# Altium schematic sheet 24V_Conv_Draft.SchDoc
size A; SheetNumber: 16; SheetTotal: 16
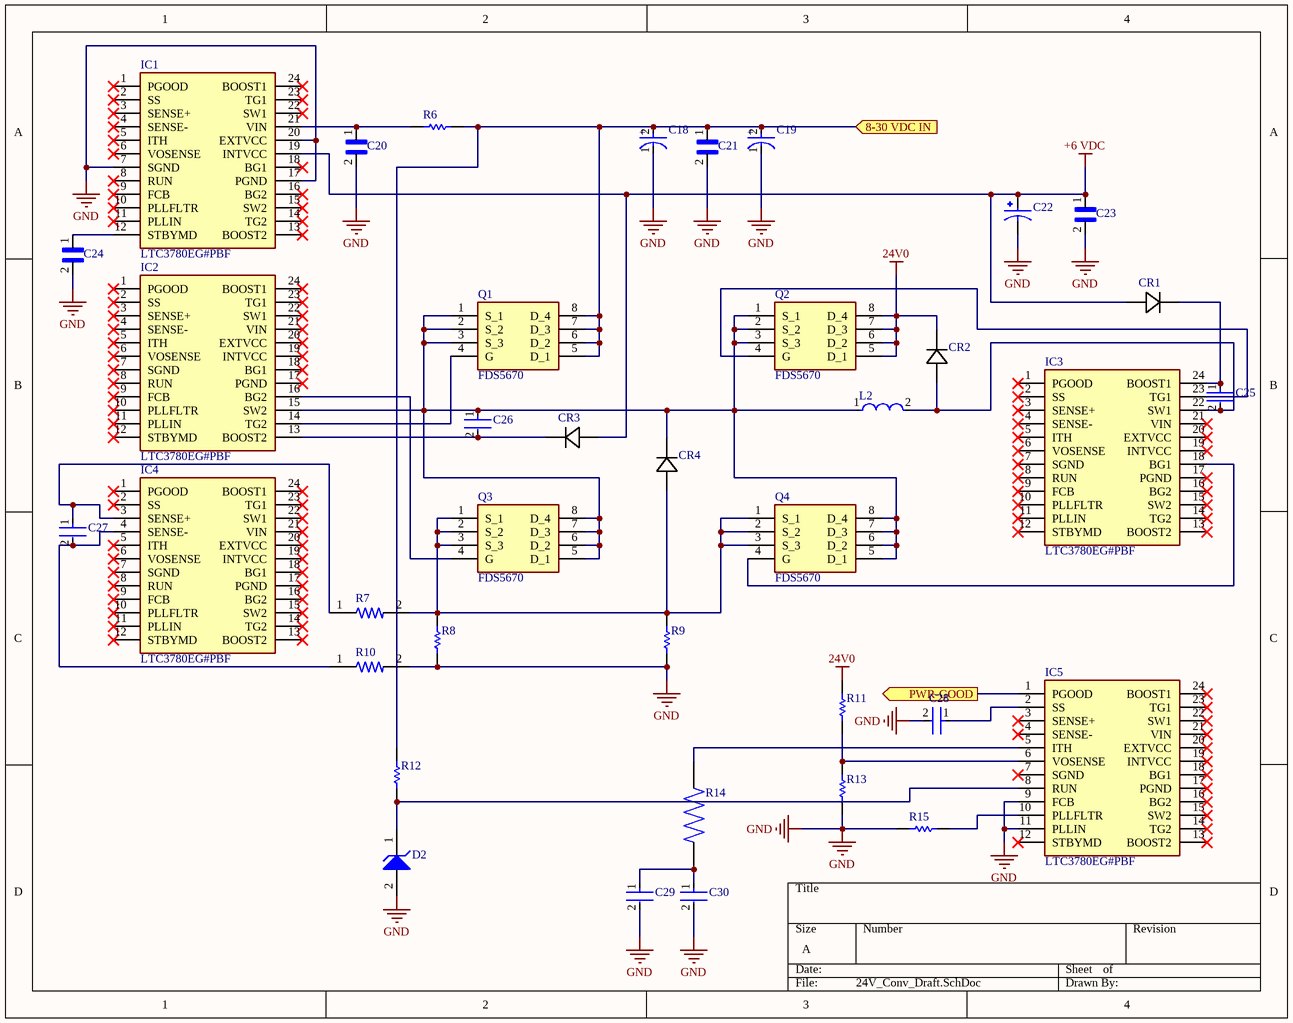
[diagram p0: 24V_Conv_Draft.SchDoc]

## Parts
C18  35SVPF22M  [FP-SVPFC6-MFG]  (value not drawn)
C19  EEE-HA1E221UP  [FP-HAF-MFG]  (value not drawn)
C20  GRM022R60J104ME15L  [CAPC0402X22N]  (value not drawn)
C21  GRM022R60J104ME15L  [CAPC0402X22N]  (value not drawn)
C22  EEVEB2V4R7Q  [CAP_EEVEB2V4R7Q]  (value not drawn)
C23  GRM022R60J104ME15L  [CAPC0402X22N]  (value not drawn)
C24  GRM022R60J104ME15L  [CAPC0402X22N]  (value not drawn)
C25  C0805C224K5RACTU  [FP-C0805C-DN-IPC_A]  (value not drawn)
C26  C0805C224K5RACTU  [FP-C0805C-DN-IPC_A]  (value not drawn)
C27  C1206C680J5GACTU  [FP-C1206C-EB-MFG]  (value not drawn)
C28  CC0805KRX7R9BB223  [FP-CC0805-0_85-IPC_C]  (value not drawn)
C29  C1206C470J5GACTU  [FP-C1206C-EB-MFG]  (value not drawn)
C30  CC0603KRX7R9BB103  [FP-CC0603-DA-IPC_B]  (value not drawn)
CR1  SS34-E3/9AT  [CR_3/9AT_VIS]  (value not drawn)
CR2  SS34-E3/9AT  [CR_3/9AT_VIS]  (value not drawn)
CR3  SS34-E3/9AT  [CR_3/9AT_VIS]  (value not drawn)
CR4  SS34-E3/9AT  [CR_3/9AT_VIS]  (value not drawn)
D2  MMSZ4689T1G  [ONSC-SOD-123-2-425-04_V]  (value not drawn)
IC1  LTC3780EG#PBF  [SOP65P780X200-24N]
IC2  LTC3780EG#PBF  [SOP65P780X200-24N]
IC3  LTC3780EG#PBF  [SOP65P780X200-24N]
IC4  LTC3780EG#PBF  [SOP65P780X200-24N]
IC5  LTC3780EG#PBF  [SOP65P780X200-24N]
L2  IHLP5050CEER4R7M01  [FP-IHLP-5050CE-FP_3_175x3-MFG]  (value not drawn)
Q1  FDS5670  [SOIC127P600X175-8N]
Q2  FDS5670  [SOIC127P600X175-8N]
Q3  FDS5670  [SOIC127P600X175-8N]
Q4  FDS5670  [SOIC127P600X175-8N]
R6  ERJ-6ENF10R0V  [RESC2013X70X40NL20T20]  (value not drawn)
R7  CRGS0805J100R  [RESC2012X65N]  (value not drawn)
R8  ERJ8BWFR018V  [RESC3216X70X50NL05T20]  (value not drawn)
R9  ERJ8BWFR018V  [RESC3216X70X50NL05T20]  (value not drawn)
R10  CRGS0805J100R  [RESC2012X65N]  (value not drawn)
R11  CRCW1206294KFKEA  [RESC3216X60X45ML10T20]  (value not drawn)
R12  ERJ3EKF1002V  [RESC1609X55X30LL15T15]  (value not drawn)
R13  ERJ3EKF1002V  [RESC1609X55X30LL15T15]  (value not drawn)
R14  RC1206JR-07100KL  [RESC3116X65N]  (value not drawn)
R15  ERJ3EKF1002V  [RESC1609X55X30LL15T15]  (value not drawn)

## Ports
8-30 VDC IN (in), PWR-GOOD (out)

## Nets
24V0: CR2.2(ANODE) Q2.5(D_1) Q2.6(D_2) Q2.7(D_3) Q2.8(D_4) R11.1
+6 VDC: C22.1 C23.1 CR1.1(CATHODE) CR3.1(CATHODE) IC1.19(INTVCC)
GND: C18.1(C) C19.1(C) C20.2 C21.2 C22.2 C23.2 C24.2 C28.2 C29.2 C30.2 D2.2(A) IC1.7(SGND) IC1.17(PGND) IC1.20(EXTVCC) IC5.9(FCB) IC5.11(PLLIN) R8.2 R9.2 R10.2 R13.2 R15.2
8-30 VDC IN: C18.2(A) C19.2(A) C21.1 Q1.5(D_1) Q1.6(D_2) Q1.7(D_3) Q1.8(D_4) R6.2 R12.1 ; port 8-30 VDC IN
PWR-GOOD: IC5.1(PGOOD) ; port PWR-GOOD
NetC20_1: C20.1 IC1.21(VIN) R6.1
NetC24_1: C24.1 IC1.12(STBYMD)
NetC25_1: C25.1 CR1.2(ANODE) IC3.24(BOOST1)
NetC25_2: C25.2 CR2.1(CATHODE) IC3.22(SW1) L2.2
NetC26_1: C26.1 CR4.2(ANODE) IC2.15(SW2) L2.1 Q1.1(S_1) Q1.2(S_2) Q1.3(S_3) Q2.1(S_1) Q2.2(S_2) Q2.3(S_3) Q3.5(D_1) Q3.6(D_2) Q3.7(D_3) Q3.8(D_4) Q4.5(D_1) Q4.6(D_2) Q4.7(D_3) Q4.8(D_4)
NetC26_2: C26.2 CR3.2(ANODE) IC2.13(BOOST2)
NetC27_1: C27.1 IC4.3(SENSE+) R7.1
NetC27_2: C27.2 IC4.4(SENSE-) R10.1
NetC28_1: C28.1 IC5.2(SS)
NetC29_1: C29.1 C30.1 R14.2
NetCR4_1: CR4.1(CATHODE) Q3.1(S_1) Q3.2(S_2) Q3.3(S_3) Q4.1(S_1) Q4.2(S_2) Q4.3(S_3) R7.2 R8.1 R9.1
NetD2_1: D2.1(K) IC5.8(RUN) R12.2
NetIC2_14: IC2.14(TG2) Q1.4(G)
NetIC2_16: IC2.16(BG2) Q3.4(G)
NetIC3_18: IC3.18(BG1) Q4.4(G)
NetIC3_23: IC3.23(TG1) Q2.4(G)
NetIC5_5: IC5.5(ITH) R14.1
NetIC5_6: IC5.6(VOSENSE) R11.2 R13.1
NetIC5_10: IC5.10(PLLFLTR) R15.1

Not connected (* = marked no-connect by the designer): IC1 1(PGOOD)* 2(SS)* 3(SENSE+)* 4(SENSE-)* 5(ITH)* 6(VOSENSE)* 8(RUN)* 9(FCB)* 10(PLLFLTR)* 11(PLLIN)* 13(BOOST2)* 14(TG2)* 15(SW2)* 16(BG2)* 18(BG1)* 22(SW1)* 23(TG1)* 24(BOOST1)*; IC2 1(PGOOD)* 2(SS)* 3(SENSE+)* 4(SENSE-)* 5(ITH)* 6(VOSENSE)* 7(SGND)* 8(RUN)* 9(FCB)* 10(PLLFLTR)* 11(PLLIN)* 12(STBYMD)* 17(PGND)* 18(BG1)* 19(INTVCC)* 20(EXTVCC)* 21(VIN)* 22(SW1)* 23(TG1)* 24(BOOST1)*; IC3 1(PGOOD)* 2(SS)* 3(SENSE+)* 4(SENSE-)* 5(ITH)* 6(VOSENSE)* 7(SGND)* 8(RUN)* 9(FCB)* 10(PLLFLTR)* 11(PLLIN)* 12(STBYMD)* 13(BOOST2)* 14(TG2)* 15(SW2)* 16(BG2)* 17(PGND)* 19(INTVCC)* 20(EXTVCC)* 21(VIN)*; IC4 1(PGOOD)* 2(SS)* 5(ITH)* 6(VOSENSE)* 7(SGND)* 8(RUN)* 9(FCB)* 10(PLLFLTR)* 11(PLLIN)* 12(STBYMD)* 13(BOOST2)* 14(TG2)* 15(SW2)* 16(BG2)* 17(PGND)* 18(BG1)* 19(INTVCC)* 20(EXTVCC)* 21(VIN)* 22(SW1)* 23(TG1)* 24(BOOST1)*; IC5 3(SENSE+)* 4(SENSE-)* 7(SGND)* 12(STBYMD)* 13(BOOST2)* 14(TG2)* 15(SW2)* 16(BG2)* 17(PGND)* 18(BG1)* 19(INTVCC)* 20(EXTVCC)* 21(VIN)* 22(SW1)* 23(TG1)* 24(BOOST1)*

## Notes on the sheet
- (in symbol CMP-05427-000013-1) +
- (in symbol CMP-05428-000019-1) +

## Library data of the parts
C18 = CMP-05428-000019-1: CAP ALUM POLY 22UF 20% 35V SMD; Ripple Current (AC): 2.6A; Life (Hours): 5000Hour; Leakage Current: 154uA; Polarity: Polar; Dissipation Factor: 12%; ESR (Equivalent Series Resistance): 35mR; Height - Seated (Max): 0.236inch; Case/Package: Radial; Height: 5.9mm; Number of Pins: 6; Diameter: 6.3mm; Packaging: Tape and Reel; Voltage Rating (DC): 35V; Max Operating Temperature: 105°C; Ripple Current: 2.6A; Voltage Rating: 35V; Tolerance: 20%; Min Operating Temperature: -55°C; Mount: Surface Mount; REACH SVHC: No SVHC; Length: 5.9mm; Capacitance: 22uF; Package Quantity: 1000; Voltage: 35V; Termination: SMD/SMT
C19 = CMP-05427-000013-1: CAP ALUM 220UF 20% 25V SMD; Manufacturer: Panasonic; Leakage Current: 55uA; Dissipation Factor: 16%; Material: Aluminum; Life: 1000Hours; Ripple Current: 160mA; Temperature Range Low: -40°C; ComponentLink2Description: Datasheet; Automotive: No; Category: Cap; Manufacturer Part Number: EEE-HA1E221UP; Package: HAF; Device Class L3: Aluminum Electrolytic Capacitors; Device Class L1: Passive Components; Voltage: 25V; RoHS: TRUE; Height: 10.5mm; Value: 220uF; Mouser Description: Aluminum Electrolytic Capacitors - SMD 220UF 25V ELECT HA SMD; Lead Free: Yes; Device Class L2: Capacitors; Octopart: https://octopart.com/eee-ha1e221up-panasonic-39481261; Voltage Rating: 25V; Temperature Range High: +105°C; Tolerance: 20%; Temperature: -40°C to +105°C; ComponentLink2URL: https://industrial.panasonic.com/cdbs/www-data/pdf/RDE0000/ABA0000C1151.pdf; Capacitance: 220uF; Digikey Description: CAP ALUM 220UF 20% 25V SMD
C20 C21 C23 C24 = GRM022R60J104ME15L: 01005 0.1 uF 6.3 V Â±20% Tolerance X5R SMT Multilayer Ceramic Capacitor; MF: Murata Electronics; Check_prices: https://www.snapeda.com/parts/GRM022R60J104ME15L/Murata%20Electronics%20North%20America/view-part/265228/?ref=eda; Price: None; SnapEDA_Link: https://www.snapeda.com/parts/GRM022R60J104ME15L/Murata%20Electronics%20North%20America/view-part/265228/?ref=snap; Availability: In Stock; Package: 0402 Murata; MP: GRM022R60J104ME15L; Value: *; Supplier 1: Digi-Key; Supplier Part Number 1: 490-7192-1-ND
C22 = EEVEB2V4R7Q: CAP ALUM 4.7UF 20% 350V SMD; MF: Panasonic Electronic Components; MP: EEV-EB2V4R7Q; Availability: In Stock; Price: None; SnapEDA_Link: https://www.snapeda.com/parts/EEV-EB2V4R7Q/Panasonic%20Electronic%20Components/view-part/3655945/?ref=snap; Value: *; Check_prices: https://www.snapeda.com/parts/EEV-EB2V4R7Q/Panasonic%20Electronic%20Components/view-part/3655945/?ref=eda; Package: RADIAL-2 Panasonic; ComponentLink1Description: New link; ComponentLink1URL: *
C25 C26 = CMP-1036-04552-2: CAP CER 0.22UF 50V X7R 0805; Manufacturer: KEMET; Value: 0.22 μF; Temperature Coefficient: 30ppm/°C; Material: Ceramic; Tolerance: 0.1; ComponentLink2URL: https://content.kemet.com/datasheets/KEM_C1003_C0G_SMD.pdf; Temperature Characteristic: X7R; Device Class L3: Ceramic Capacitors; Lead Free: Yes; Temperature: -55°C to +125°C; RoHS: TRUE; Capacitance: 0.22 μF; Automotive: No; Octopart: https://octopart.com/c0805c224k5ractu-kemet-144670; Manufacturer Part Number: C0805C224K5RACTU; Temperature Range Low: -55°C; Height: 0.88mm; Device Class L1: Passive Components; Digikey Description: CAP CER 0.22UF 50V X7R 0805; ComponentLink2Description: Datasheet; Mouser Description: CAP CER 0.22UF 50V X7R 0805; Category: Cap; Ipc Land Pattern Name: CAPC200125X78; Temperature Range High: +125°C; Package: C0805C-DN; Device Class L2: Capacitors; Voltage Rating: 50 V
C27 = CMP-03020-008221-1: 1206 C 68pF Ceramic Multilayer Capacitor; 50 VDC; +125degC; C0G Dielec; +/-5%; Manufacturer: KEMET; Tolerance: 0.05; Temperature Coefficient: 15%; Voltage Rating: 50 V; Automotive Grade: Grade 0; Temperature Range High: +150°C; Octopart: https://octopart.com/c1206c680j5gactu-kemet-138975; ComponentLink2Description: Datasheet; ComponentLink2URL: https://content.kemet.com/datasheets/KEM_C1007_X8R_ULTRA_150C_SMD.pdf; Lead Free: Yes; Height: 0.88mm; Category: Cap; Temperature Range Low: -55°C; Temperature Characteristic: C0G; Manufacturer Part Number: C1206C680J5GACTU; Device Class L2: Capacitors; Automotive: Yes; Device Class L1: Passive Components; Digikey Description: 1206 C 68pF Ceramic Multilayer Capacitor; 50 VDC; +125degC; C0G Dielec; +/-5%; RoHS: TRUE; Temperature: -55°C to +150°C; Capacitance: 68 pF; Material: Ceramic; Value: 68 pF; Package: C1206C-EB; Ipc Land Pattern Name: CAPC320160X78; Mouser Description: 1206 C 68pF Ceramic Multilayer Capacitor; 50 VDC; +125degC; C0G Dielec; +/-5%; Device Class L3: Ceramic Capacitors
C28 = CMP-1036-04064-2: CAP CER 0.022UF 50V X7R 0805; Manufacturer: Yageo; Value: 22 nF; Material: Ceramic; Tolerance: 0.1; Temperature Range High: +85°C; Mouser Description: Multilayer Ceramic Capacitors MLCC - SMD/SMT 22nF 50V X7R 10%; Package: CC0805-0.85; Automotive: No; Temperature Characteristic: X7R; ComponentLink2Description: Datasheet; Manufacturer Part Number: CC0805KRX7R9BB223; Capacitance: 22 nF; Ipc Land Pattern Name: CAPC200125X85; Digikey Description: CAP CER 0.022UF 50V X7R 0805; Temperature: -30°C to +85°C; Height: 0.95mm; Temperature Range Low: -30°C; Category: Cap; Voltage Rating: 50 V; Device Class L3: Ceramic Capacitors; Device Class L1: Passive Components; Octopart: https://octopart.com/cc0805krx7r9bb223-yageo-39467761; Lead Free: Yes; Device Class L2: Capacitors; ComponentLink2URL: http://www.yageo.com/documents/recent/UPY-GPHC_Y5V_6.3V-to-50V_8.pdf; RoHS: TRUE; Footprint Url: http://www.yageo.com/exep/pages/download/literatures/UPY-C_GEN_24.pdf
C29 = CMP-03020-017724-1: CAP CER 47PF 50V C0G/NP0 1206; Manufacturer: KEMET; Temperature Coefficient: 15%; Automotive Grade: Grade 0; Tolerance: 0.05; Temperature Characteristic: C0G; Material: Ceramic; ComponentLink2URL: https://content.kemet.com/datasheets/KEM_C1007_X8R_ULTRA_150C_SMD.pdf; Temperature: -55°C to +150°C; Automotive: Yes; Manufacturer Part Number: C1206C470J5GACTU; RoHS: TRUE; Value: 47 pF; Ipc Land Pattern Name: CAPC320160X78; Voltage Rating: 50 V; Device Class L3: Ceramic Capacitors; Device Class L1: Passive Components; Lead Free: Yes; Device Class L2: Capacitors; ComponentLink2Description: Datasheet; Capacitance: 47 pF; Temperature Range Low: -55°C; Package: C1206C-EB; Height: 0.88mm; Category: Cap; Octopart: https://octopart.com/c1206c470j5gactu-kemet-96509; Temperature Range High: +150°C; Digikey Description: CAP CER 47PF 50V C0G/NP0 1206; Mouser Description: Multilayer Ceramic Capacitors MLCC - SMD/SMT 50volts 47pF C0G 5%
C30 = CMP-2100-03600-2: CAP CER 10000PF 50V X7R 0603; Manufacturer: YAGEO; Tolerance: 0.1; Material: Ceramic; Temperature Coefficient: 15%; Value: 10 nF; Mouser Description: Multilayer Ceramic Capacitor, CC Series, 0.01 - F, - 10%, X7R, 50 V, 0603 [1608 Metric]; Digikey Description: CAP CER 10000PF 50V X7R 0603; Height: 0.9mm; Category: Cap; Temperature Characteristic: X7R; Footprint Url: http://www.yageo.com/exep/pages/download/literatures/UPY-C_GEN_24.pdf; Lead Free: Yes; Voltage Rating: 50 V; Manufacturer Part Number: CC0603KRX7R9BB103; Temperature: -55°C to +125°C; Device Class L3: Ceramic Capacitors; ComponentLink2Description: Datasheet; Voltage: 50 V; Package: CC0603-DA; Octopart: https://octopart.com/cc0603krx7r9bb103-yageo-192938; Automotive: No; Temperature Range High: +125°C; Temperature Range Low: -55°C; RoHS: TRUE; Device Class L1: Passive Components; ComponentLink2URL: http://www.yageo.com/documents/recent/UPY-GPHC_X7R_6.3V-to-50V_18.pdf; Device Class L2: Capacitors; Capacitance: 10 nF
CR1-CR4 = SS34-E3/9AT: No Description Available; Mfr_Name: Vishay; Type: DEV; Copyright: Copyright (C) 2021 Ultra Librarian. All rights reserved.; Manufacturer_Part_Number: SS34-E3/9AT; RefDes: RefDes
D2 = CMP-1060-00416-1: Zener Voltage Regulator, 500 mW, 2-Pin SOD-123, Pb-Free, Tape and Reel; Manufacturer: On Semiconductor; VZ Typ (V): 5.1; P Max (W): 0.5; ComponentLink2URL: http://www.onsemi.com/pub_link/Collateral/MMSZ4678T1-D.PDF; PackageVersion: Rev. G, 10/2009; ComponentLink1Description: Manufacturer URL; PackageDescription: 2-Pin SOD, Body 1.6 x 2.69 mm; PartNumber: MMSZ4689T1G; DatasheetVersion: Rev. 9; PackageReference: SOD-123-2-425-04; RoHS: Pb-Free; Mounting Technology: Surface Mount; ComponentLink3URL: http://www.onsemi.com/pub_link/Collateral/425-04.PDF; ComponentLink2Description: Datasheet; ComponentLink1URL: http://www.onsemi.com/; ComponentLink3Description: Package Specification; Packing: Tape and Reel
IC1-IC5 = LTC3780EG#PBF: Integrated Circuit; Manufacturer_Name: Linear Technology; Datasheet Link: https://datasheet.datasheetarchive.com/originals/distributors/Datasheets-SFU1/DSASFU10009110.pdf; Height: 2mm; Manufacturer_Part_Number: LTC3780EG#PBF; Mouser Part Number: 584-LTC3780EG#PBF; Mouser Price/Stock: https://www.mouser.co.uk/ProductDetail/Analog-Devices-Linear-Technology/LTC3780EGPBF?qs=hVkxg5c3xu%252BOBZugU8NO3w%3D%3D; Arrow Part Number: LTC3780EG#PBF; Arrow Price/Stock: https://www.arrow.com/en/products/ltc3780egpbf/linear-technology
L2 = CMP-02424-000578-1: Commercial Inductors, High Saturation Series 4.7uH 10A 15mΩ 20%; Saturation Current: 24A; Core Material: Metal; Shielding: Shielded; DC Resistance (DCR): 15mR; Self Resonant Frequency: 5MHz; Test Frequency: 100kHz; Max Operating Temperature: 125°C; Package Quantity: 500; Termination: SMD/SMT; Inductance Tolerance: 20%; Radiation Hardening: No; Height - Seated (Max): 0.138inch; Lead Free: Lead Free; Width: 0.508inch; Packaging: Tape and Reel; Inductance: 4.7uH; Case/Package: 5050; Length: 13.2mm; Height: 3.5mm; Mount: Surface Mount; Min Operating Temperature: -55°C; Current Rating: 10A; RMS Current (Irms): 10A; Military Standard: Not; Max DC Current: 10A; Tolerance: 20%; Depth: 12.9mm; Number of Pins: 5050
Q1-Q4 = FDS5670: MOSFET (N-Channel); Manufacturer_Name: ON Semiconductor; Datasheet Link: https://eagle.componentsearchengine.com/Datasheets/2/FDS5670.pdf; Height: 1.75mm; Manufacturer_Part_Number: FDS5670; Mouser Part Number: 512-FDS5670; Mouser Price/Stock: https://www.mouser.com/Search/Refine.aspx?Keyword=512-FDS5670; Arrow Part Number: FDS5670; Arrow Price/Stock: https://www.arrow.com/en/products/fds5670/on-semiconductor
R6 = CMP-1013-00284-2: Manufacturer: Panasonic; Part Number: ERJ-6ENF10R0V
R7 R10 = CRGS0805J100R: 100 Ohms Â±5% 0.5W, 1/2W Chip Resistor 0805 _2012 Metric_ Pulse Withstanding Thick Film; MF: TE Connectivity; TE_purchase_URL: https://www.te.com/usa-en/product-2-2176244-5.html?te_bu=Cor&te_type=disp&te_campaign=seda_glo_cor-seda-global-disp-prtnr-fy19-seda-model-bom-cta_sma-317_1&elqCampaignId=32493; Package: 0805 TE Connectivity; SnapEDA_Link: https://www.snapeda.com/parts/CRGS0805J100R/TE%20Connectivity%20AMP%20Connectors/view-part/1008227/?ref=snap; MP: CRGS0805J100R; Value: *; Availability: Unavailable; Price: None; Supplier 1: Mouser; Supplier Part Number 1: 279-CRGS0805J100R
R8 R9 = CMP-2003-00769-1: Manufacturer: Panasonic; Part Number: ERJ8BWFR018V
R11 = CMP-2003-02025-1: Manufacturer: Vishay Dale; Part Number: CRCW1206294KFKEA
R12 R13 R15 = CMP-1012-00623-3: Chip Resistor, 10 KOhm, +/- 1%, 0.1 W, -55 to 155 degC, 0603 (1608 Metric), RoHS, Tape and Reel; Manufacturer: Panasonic; Voltage Rating: 75V; Case\/Package: 0603; Power Rating: 100mW; Resistance: 10KOhm; Temperature Coefficient: 100ppm\/degreesC; Number of Pins: 2; Package Reference: 603; Depth: 0.8mm; Mount: SurfaceMount; Package Description: 2-Pin Surface Mount Device, Body 1.6 x 0.85 mm; Datasheet Version: 02/2017; Length: 1.6mm; Lead Free: LeadFree; Height: 0.45mm; Number of Terminations: 2; Max Power Dissipation: 100mW; Min Operating Temperature: -55degC; Datasheet URL: https://industrial.panasonic.com/cdbs/www-data/pdf/RDA0000/AOA0000C304.pdf; Termination: SMD/SMT; Case Code (Metric): 1608; Case Code (Imperial): 0603; Tolerance: 1%; Max Operating Temperature: 155degC; RoHSCompliant: true; Voltage Rating (DC): 75V; Radiation Hardening: No; Packaging: TapeandReel; Composition: ThickFilm; Mounting Technology: SurfaceMount; Manufacturer URL: http://www.panasonic.com/; Width: 0.031inch; REACH SVHC: NoSVHC; Contact Plating: Tin; Military Standard: Not; Package Quantity: 1
R14 = RC1206JR-07100KL: Carbon film resistor 100 kâ„¦ SMD 1206 0.25 W 5 % 200 ppm Yageo RC1206JR-07100KL 1 pc(s); Package: None; Price: None; Value: *; MP: RC1206JR-07100KL; Availability: Unavailable; Supplier 1: Digi-Key; Supplier Part Number 1: 311-100KERCT-ND